# EAGLE design pureModExample (EAGLE 7.6.0)
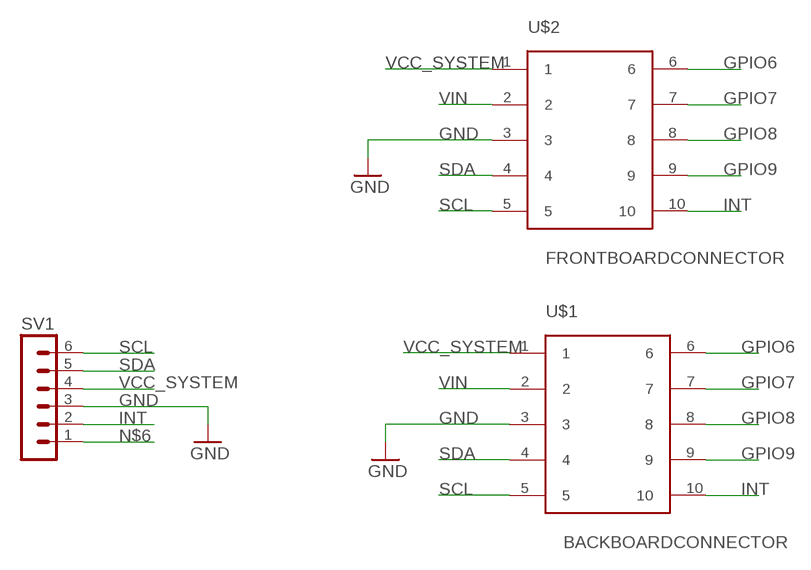
[diagram p0: schematic, sheet 1]

## Parts
SV1  MA06-1  [MA06-1]
U$1  BACKBOARDCONNECTOR  [BACKBOARDCONNECTOR]
U$2  FRONTBOARDCONNECTOR  [FRONTBOARDCONNECTOR]

## Nets
GND: SV1.3 U$1.3 U$2.3
GPIO6: U$1.6 U$2.6
GPIO7: U$1.7 U$2.7
GPIO8: U$1.8 U$2.8
GPIO9: U$1.9 U$2.9
INT: SV1.2 U$1.10 U$2.10
N$6: SV1.1
SCL: SV1.6 U$1.5 U$2.5
SDA: SV1.5 U$1.4 U$2.4
VCC_SYSTEM: SV1.4 U$1.1 U$2.1
VIN: U$1.2 U$2.2

## Library data of the parts
SV1 = con-lstb:MA06-1: PIN HEADER; OC_FARNELL: unknown; OC_NEWARK: unknown
U$1 = eagleexample:BACKBOARDCONNECTOR
U$2 = eagleexample:FRONTBOARDCONNECTOR

## Board
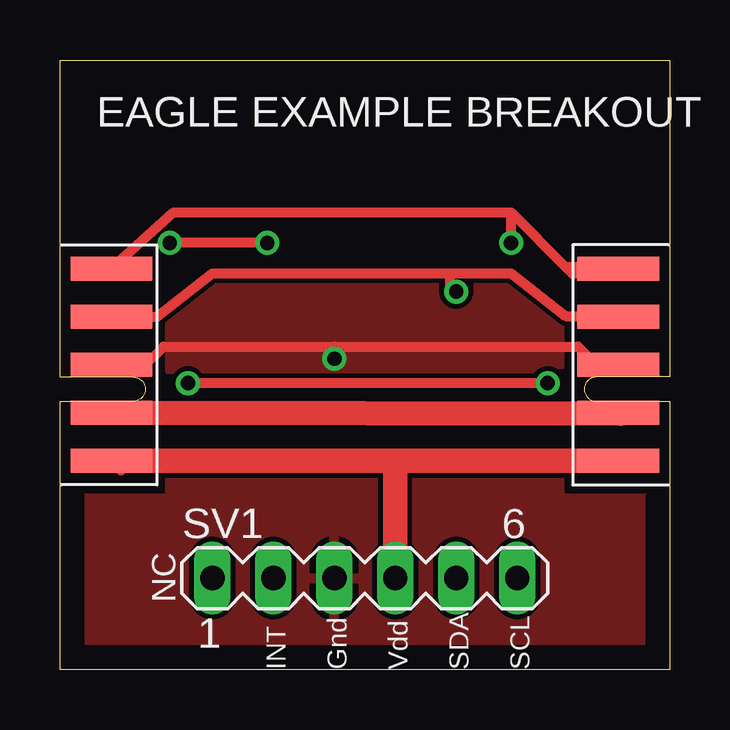
[diagram p1: board, top side]
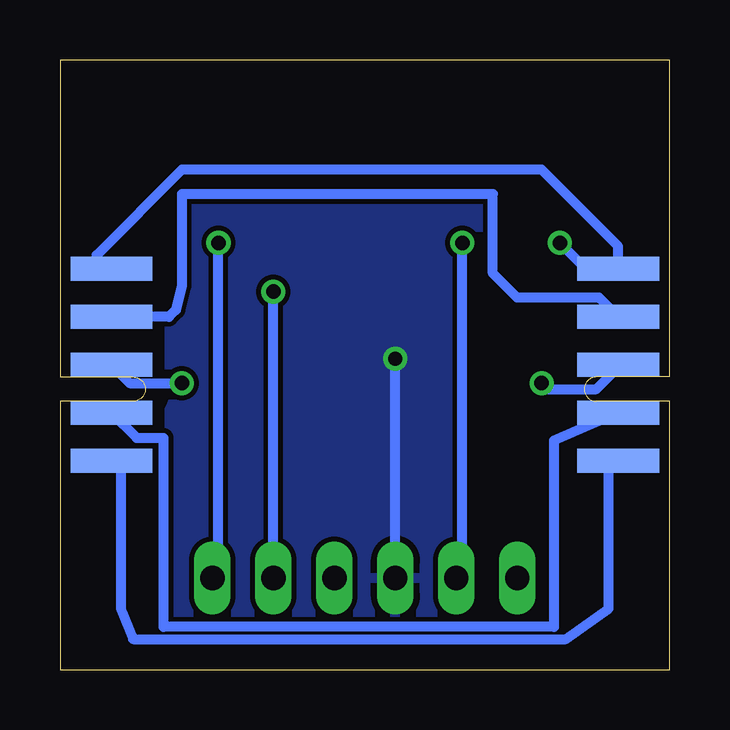
[diagram p2: board, bottom side, seen from below]

Size 25.4 x 25.4 mm. Coordinates in mm from the lower left corner, seen from the top.
Outline: 0,25.4 25.4,25.4 25.4,12.19 22.35,12.19 arc180 22.35,11.18 25.4,11.18 25.4,0 0,0 0,11.18 3.05,11.18 arc180 3.05,12.19 0,12.19 0,25.4
Copper layers (1*16): Top 0.035mm / dielectric 1.5mm / Bottom 0.035mm
Design rules "default": minimum track width 10mil, minimum drill 24mil, track to track 8mil, track to pad 8mil, pad to pad 8mil, via to via 8mil, smd to smd 8mil, copper to edge 40mil, drill to drill 8mil, minimum pad ring 10mil, minimum via ring 8mil, stop-mask expansion 4mil, vias tented up to drill 0mil, thermal gap 10mil

### Footprints (pad centres in the part's own frame; a part is rotated, then mirrored left to right if it is on the bottom)
MA06-1 = drill 1.016 long: 1 -6.35,0; 2 -3.81,0; 3 -1.27,0; 4 1.27,0; 5 3.81,0; 6 6.35,0
BACKBOARDCONNECTOR = smd 1 x 3.4: 1 4,-0.4; 2 2,-0.4; 3 0,-0.4; 4 -2,-0.4; 5 -4,-0.4 | smd 1 x 3.4 bottom: 6 4,-0.4; 7 2,-0.4; 8 0,-0.4; 9 -2,-0.4; 10 -4,-0.4
FRONTBOARDCONNECTOR = smd 1 x 3.4: 1 4,0.4; 2 2,0.4; 3 0,0.4; 4 -2,0.4; 5 -4,0.4 | smd 1 x 3.4 bottom: 6 4,0.4; 7 2,0.4; 8 0,0.4; 9 -2,0.4; 10 -4,0.4

### Placement (x,y rotation side)
SV1  12.7,3.81 0 top
U$1  2.54,12.7 270 top
U$2  22.86,12.7 270 top

### Tracks (layer width: path | path; a pad name or v marks a point on that pad's centre or on a via)
GND  (via drill 0.6)
  Top 0.406: U$1.3 3.56,12.7 4.32,13.46 11.43,13.46 | 11.43,13.46 21.59,13.46 22.35,12.7 | v11.43,12.95 11.43,13.46 | 22.61,12.45 22.35,12.7 | 22.35,12.7 U$2.3
  Bottom 0.406: SV1.3 v11.43,12.95
  pour Bottom: 0,25.4 0,18.29 4.57,18.29 4.57,7.11 0,7.11 0,0 25.4,0 25.4,7.11 20.83,7.11 20.83,18.29 25.4,18.29 25.4,25.4
  pour Top: 0,25.4 0,18.29 4.57,18.29 4.57,7.11 0,7.11 0,0 25.4,0 25.4,7.11 20.83,7.11 20.83,18.29 25.4,18.29 25.4,25.4
GPIO6
  Bottom 0.406: U$2.6 22.86,8.3 22.86,2.54 22.35,1.27 4.32,1.27 2.54,2.54 2.54,8.3 | 2.54,8.3 2.54,8.89 | 2.33,8.89 U$1.6 2.54,8.3
GPIO7
  Bottom 0.406: U$1.7 4.83,9.54 4.83,1.78 21.08,1.78 21.08,9.65 22.21,9.65 U$2.7
GPIO8  (via drill 0.6)
  Top 0.406: v20.32,11.94 v5.33,11.94
  Bottom 0.406: U$2.8 22.5,11.94 v20.32,11.94 | v5.33,11.94 5.08,11.68 3.05,11.68 2.14,12.59 U$1.8
GPIO9
  Bottom 0.406: U$1.9 2.93,15.49 6.35,15.49 7.37,16.51 7.37,19.81 20.32,19.81 20.32,16 20.57,14.99 20.86,14.7 U$2.9
INT  (via drill 0.6)
  Top 0.406: v8.64,17.78 v4.57,17.78
  Bottom 0.406: U$2.10 23.32,16.76 23.88,16.76 23.88,17.27 20.32,20.83 5.33,20.83 2.14,17.63 U$1.10 3.49,16.7 v4.57,17.78 | SV1.2 8.64,4.06 v8.64,17.78
SCL  (via drill 0.6)
  Top 0.406: U$1.5 4.74,19.05 18.8,19.05 | 18.8,19.05 21.08,16.76 | 21.08,16.76 21.34,16.51 22.61,16.51 | 22.61,16.51 22.35,16.76 21.08,16.76 | v18.8,17.78 18.8,19.05 | 23.37,16.76 23.32,16.76 U$2.5 22.8,16.7 22.61,16.51
  Bottom 0.406: SV1.6 18.8,4.06 v18.8,17.78
SDA  (via drill 0.6)
  Top 0.406: U$1.4 4.03,14.7 6.35,16.51 16.26,16.51 | 16.26,16.51 18.8,16.51 21.08,14.73 23.23,14.73 U$2.4 | v16.51,15.75 arc-90 16.26,16 16.26,16.51
  Bottom 0.406: 16.26,4.06 SV1.5 v16.51,15.75
VCC_SYSTEM
  Top 0.406: U$1.1 2.54,8.3 | U$1.1 arc90 2.2,8.64 2.29,8.64 2.54,8.89 2.79,8.89 | U$1.1 3.62,8.7
  Top 1.016: 3.62,8.7 13.97,8.7 | 13.97,8.7 U$2.1 | SV1.4 13.97,8.7
VIN
  Top 0.406: 23.37,10.67 23.37,10.7 U$2.2
  Top 1.016: U$1.2 23.37,10.67

### Text on the board
tPlace: EAGLE EXAMPLE BREAKOUT | NC | INT | Gnd | Vdd | SDA | SCL